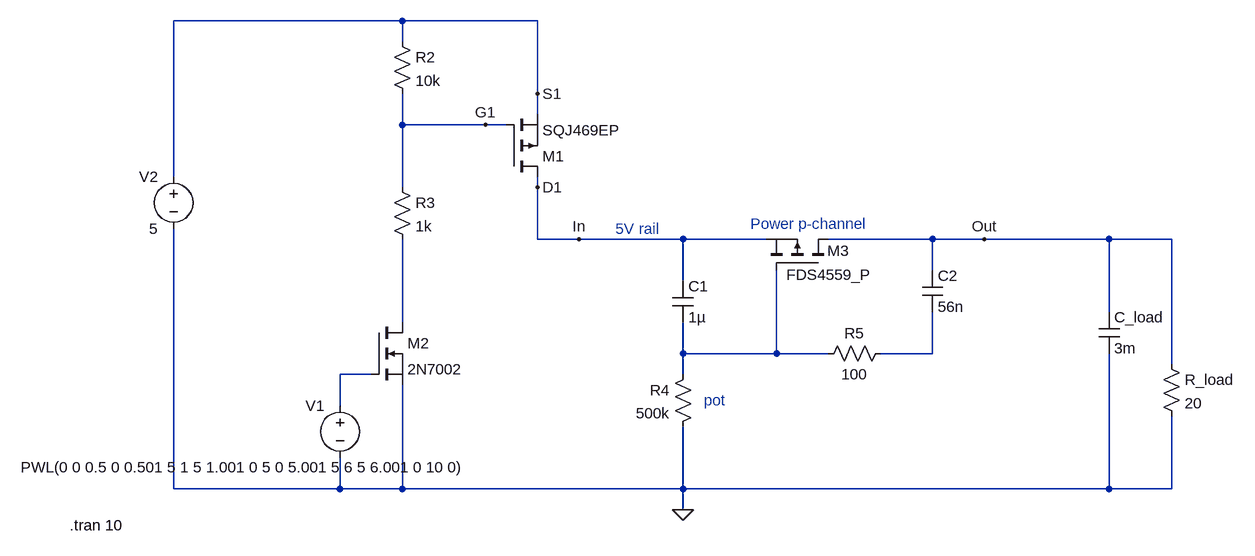
[diagram p0: schematic slow-start-circuit.asc]
slow-start-circuit.asc, the LTspice schematic file:
Version 4
SHEET 1 1448 680
WIRE 160 -224 -192 -224
WIRE 368 -224 160 -224
WIRE 160 -192 160 -224
WIRE 368 -112 368 -224
WIRE 368 -80 368 -112
WIRE 160 -64 160 -112
WIRE 288 -64 160 -64
WIRE 320 -64 288 -64
WIRE -192 16 -192 -224
WIRE 160 32 160 -64
WIRE 368 32 368 16
WIRE 368 112 368 32
WIRE 432 112 368 112
WIRE 592 112 432 112
WIRE 720 112 592 112
WIRE 976 112 816 112
WIRE 1056 112 976 112
WIRE 1248 112 1056 112
WIRE 1344 112 1248 112
WIRE 976 160 976 112
WIRE 592 176 592 112
WIRE 1248 224 1248 112
WIRE 160 240 160 112
WIRE 592 288 592 240
WIRE 736 288 736 160
WIRE 736 288 592 288
WIRE 816 288 736 288
WIRE 976 288 976 224
WIRE 976 288 896 288
WIRE 1344 304 1344 112
WIRE 112 320 64 320
WIRE 592 320 592 288
WIRE 64 368 64 320
WIRE -192 496 -192 96
WIRE 64 496 64 448
WIRE 64 496 -192 496
WIRE 160 496 160 336
WIRE 160 496 64 496
WIRE 592 496 592 400
WIRE 592 496 160 496
WIRE 1248 496 1248 288
WIRE 1248 496 592 496
WIRE 1344 496 1344 384
WIRE 1344 496 1248 496
WIRE 592 528 592 496
FLAG 592 528 0
FLAG 368 32 D1
FLAG 288 -64 G1
FLAG 368 -112 S1
FLAG 1056 112 Out
FLAG 432 112 In
SYMBOL pmos 320 16 M180
SYMATTR InstName M1
SYMATTR Value SQJ469EP
SYMBOL voltage 64 352 M0
WINDOW 123 0 0 Left 0
WINDOW 39 0 0 Left 0
WINDOW 3 -198 111 Left 2
SYMATTR Value PWL(0 0 0.5 0 0.501 5 1 5 1.001 0 5 0 5.001 5 6 5 6.001 0 10 0)
SYMATTR InstName V1
SYMBOL voltage -192 0 M0
WINDOW 123 0 0 Left 0
WINDOW 39 0 0 Left 0
SYMATTR InstName V2
SYMATTR Value 5
SYMBOL res 1328 288 R0
SYMATTR InstName R_load
SYMATTR Value 20
SYMBOL nmos 112 240 R0
SYMATTR InstName M2
SYMATTR Value 2N7002
SYMBOL res 144 -208 R0
SYMATTR InstName R2
SYMATTR Value 10k
SYMBOL res 144 16 R0
SYMATTR InstName R3
SYMATTR Value 1k
SYMBOL pmos 816 160 M270
WINDOW 0 30 2 VLeft 2
WINDOW 3 -7 65 VLeft 2
SYMATTR InstName M3
SYMATTR Value FDS4559_P
SYMBOL res 608 304 M0
SYMATTR InstName R4
SYMATTR Value 500k
SYMBOL cap 576 176 R0
SYMATTR InstName C1
SYMATTR Value 1µ
SYMBOL res 912 272 R90
WINDOW 0 0 56 VBottom 2
WINDOW 3 32 56 VTop 2
SYMATTR InstName R5
SYMATTR Value 100
SYMBOL cap 960 160 R0
SYMATTR InstName C2
SYMATTR Value 56n
SYMBOL cap 1232 224 R0
SYMATTR InstName C_load
SYMATTR Value 3m
TEXT -352 552 Left 2 !.tran 10
TEXT 624 360 Left 2 ;pot
TEXT 488 96 Left 2 ;5V rail
TEXT 696 88 Left 2 ;Power p-channel

The netlist it stands for:
* slow-start-circuit.asc
M1 In G1 S1 S1 SQJ469EP
V1 N004 0 PWL(0 0 0.5 0 0.501 5 1 5 1.001 0 5 0 5.001 5 6 5 6.001 0 10 0)
V2 S1 0 5
R_load Out 0 20
M2 N001 N004 0 0 2N7002
R2 S1 G1 10k
R3 G1 N001 1k
M3 Out N002 In In FDS4559_P
R4 N002 0 500k
C1 In N002 1µ
R5 N003 N002 100
C2 Out N003 56n
C_load Out 0 3m
.model NMOS NMOS
.model PMOS PMOS
.lib standard.mos
.tran 10
* pot
* 5V rail
* Power p-channel
.backanno
.end